# EAGLE design BSB-Board (EAGLE 7.6.0)
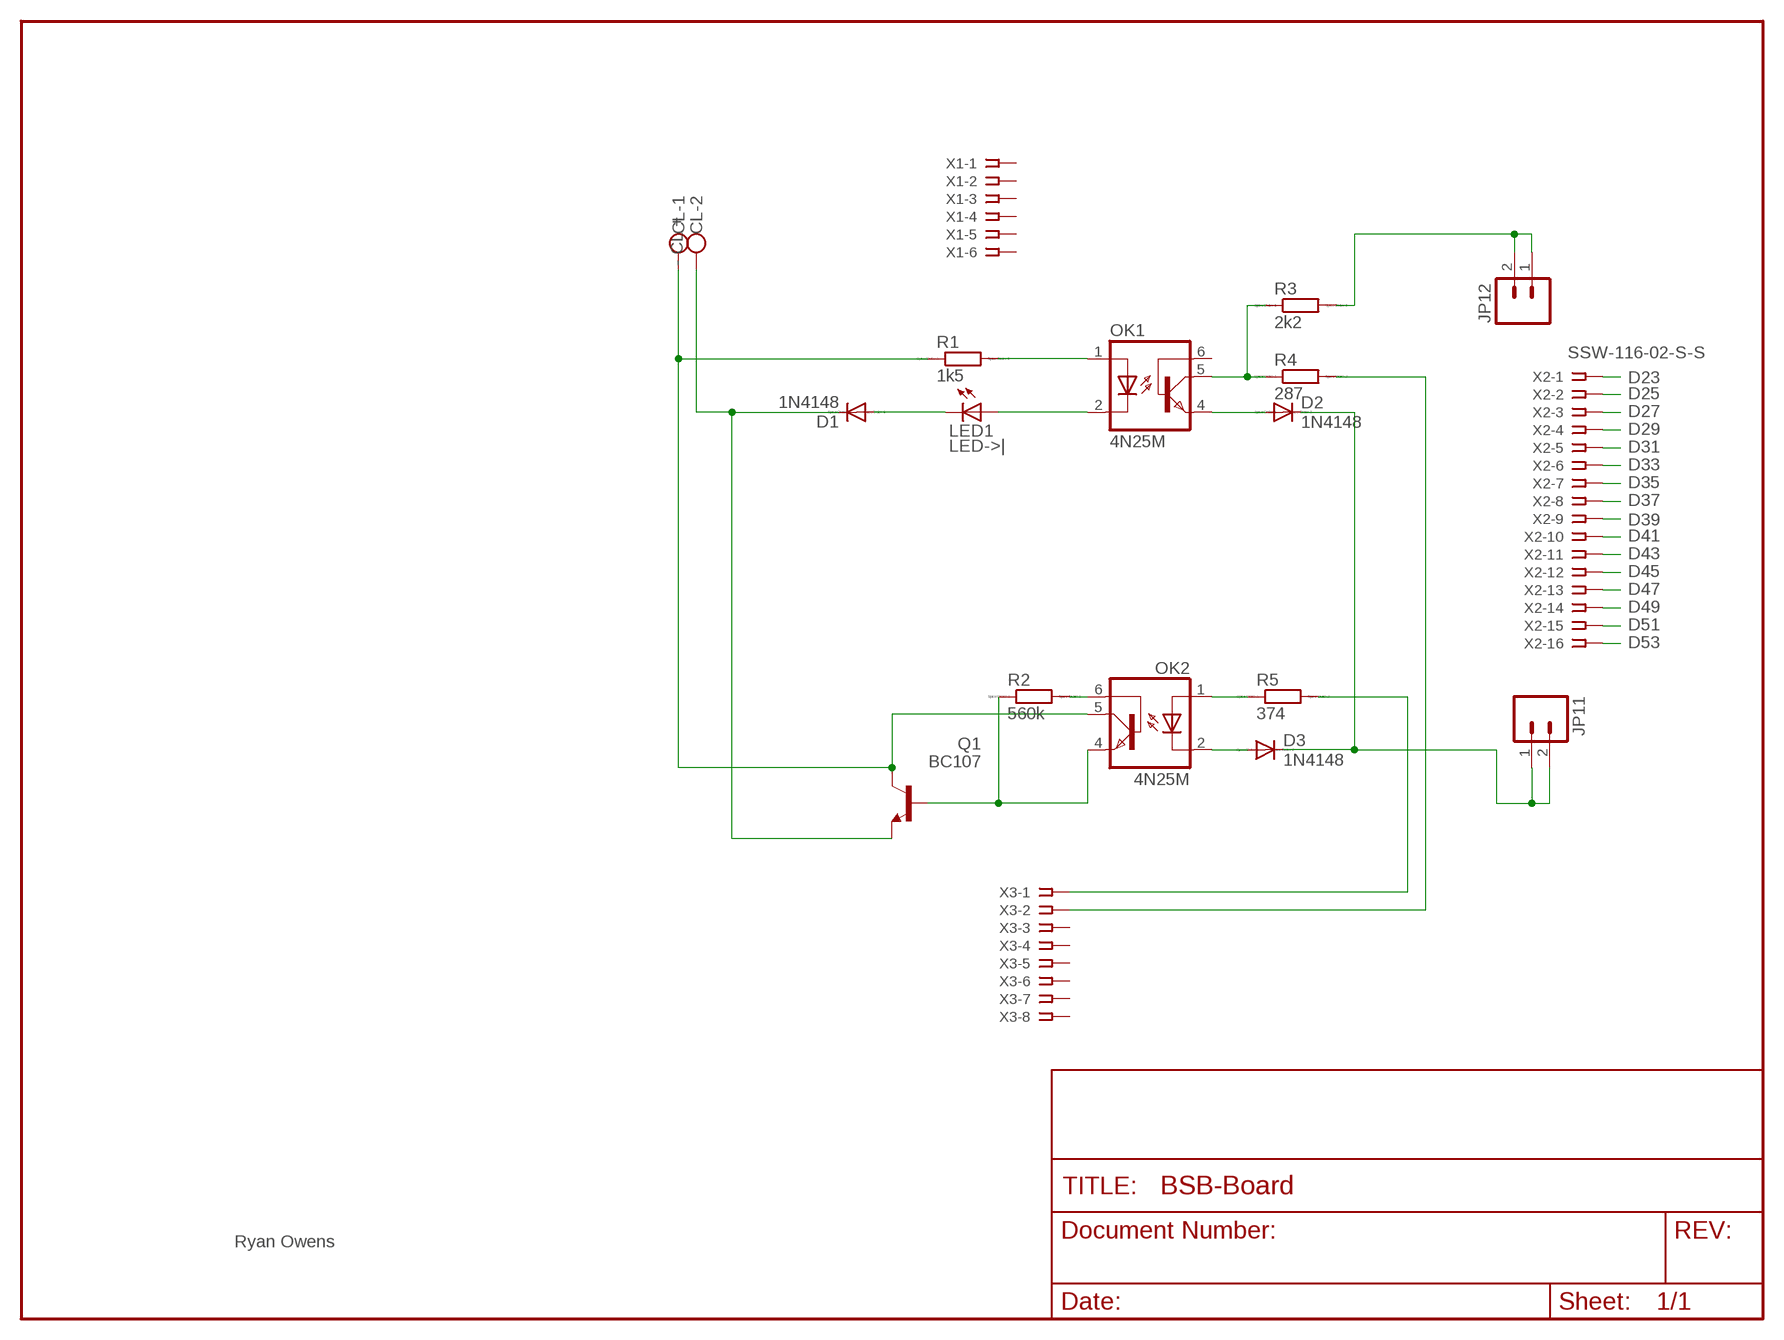
[diagram p0: schematic, sheet 1]

## Parts
CL  - CL +  W237-102  [W237-102]
D1  1N4148  1N4148DO35-7  [DO35-7]
D2  1N4148  1N4148DO35-7  [DO35-7]
D3  1N4148  1N4148DO35-7  [DO35-7]
JP11  M02LOCK  [1X02_LOCK]
JP12  M02LOCK  [1X02_LOCK]
LED1  LED->|  LEDSQR2X5  [LED2X5]
OK1  4N25M  [DIL06]
OK2  4N25M  [DIL06]
Q1  BC107  [TO18]
R1  1k5  R0204/7  [0204/7]
R2  560k  R0207/10  [0207/10]
R3  2k2  R0204/7  [0204/7]
R4  287  R0204/7  [0204/7]
R5  374  R0204/7  [0204/7]
X1  SSW-106-02-S-S  [SSW-106-02-S-S]
X2  SSW-116-02-S-S  [SSW-116-02-S-S]
X3  SSW-108-02-S-S  [SSW-108-02-S-S]

## Nets
A14: R4.2 X3.2
A15: R5.2 X3.1
D23: X2.1
D25: X2.2
D27: X2.3
D29: X2.4
D31: X2.5
D33: X2.6
D35: X2.7
D37: X2.8
D39: X2.9
D41: X2.10
D43: X2.11
D45: X2.12
D47: X2.13
D49: X2.14
D51: X2.15
D53: X2.16
GND: D2.C D3.C JP11.1 JP11.2
N$1: OK1.1(A) R1.2
N$2: LED1.A OK1.2(C)
N$3: OK2.6(BAS) R2.2
N$4: D1.A LED1.K(C)
N$5: OK2.4(EMI) Q1.2(B) R2.1
N$6: CL.1 OK2.5(COL) Q1.3(C) R1.1
N$7: CL.2 D1.C Q1.1(E)
N$8: OK1.5(COL) R3.1 R4.1
N$9: D2.A OK1.4(EMI)
N$11: OK2.1(A) R5.1
N$13: D3.A OK2.2(C)
N$14: JP12.1 JP12.2 R3.2
Unconnected: OK1.6(BAS) X1.1 X1.2 X1.3 X1.4 X1.5 X1.6 X3.3 X3.4 X3.5 X3.6 X3.7 X3.8

## Notes on the sheet
- Ryan Owens

## Library data of the parts
CL = con-wago-500:W237-102: WAGO SCREW CLAMP; MPN: 237-102; OC_FARNELL: unknown; OC_NEWARK: 70K9898
D1-D3 = diode:1N4148: DIODE high speed (Philips)
JP11 JP12 = SparkFun:M02: Header 2 Standard 2-pin 0.1" header. Use with straight break away headers (SKU : PRT-00116), right angle break away headers (PRT-00553), swiss pins (PRT-00743), machine pins (PRT-00117), and female headers (PRT-00115). Molex polarized connector foot print use with SKU : PRT-08233 with associated crimp pins and housings.
LED1 = led:LED: LED OSRAM: - CHIPLED LG R971, LG N971, LY N971, LG Q971, LY Q971, LO R971, LY R971 LH N974, LH R974 LS Q976, LO Q976, LY Q976 LO Q996 - Hyper CHIPLED LW Q18S LB Q993, LB Q99A, LB R99A - SideLED LS A670, LO A670, LY A670, LG A670, LP A670 LB A673, LV A673, LT A673, LW A673 LH A674 LY A675 LS A676, LA A676, LO A676, LY A676, LW A676 LS A679, LY A679, LG A679 - Hyper Micro SIDELED® LS Y876, LA Y876, LO Y876, LY Y876 LT Y87S - SmartLED LW L88C, LW L88S LB L89C, LB L89S, LG L890 LS L89K, LO L89K, LY L89K LS L896, LA L896, LO L896, LY L896 - TOPLED LS T670, LO T670, LY T670, LG T670, LP T670 LSG T670, LSP T670, LSY T670, LOP T670, LYG T670 LG T671, LOG T671, LSG T671 LB T673, LV T673, LT T673, LW T673 LH T674 LS T676, LA T676, LO T676, LY T676, LB T676, LH T676, LSB T676, LW T676 LB T67C, LV T67C, LT T67C, LS T67K, LO T67K, LY T67K, LW E67C LS E67B, LA E67B, LO E67B, LY E67B, LB E67C, LV E67C, LT E67C LW T67C LS T679, LY T679, LG T679 LS T770, LO T770, LY T770, LG T770, LP T770 LB T773, LV T773, LT T773, LW T773 LH T774 LS E675, LA E675, LY E675, LS T675 LS T776, LA T776, LO T776, LY T776, LB T776 LHGB T686 LT T68C, LB T68C - Hyper Mini TOPLED® LB M676 - Mini TOPLED Santana® LG M470 LS M47K, LO M47K, LY M47K Source: http://www.osram.convergy.de LUXEON: - LUMILED® LXK2-PW12-R00, LXK2-PW12-S00, LXK2-PW14-U00, LXK2-PW14-V00 LXK2-PM12-R00, LXK2-PM12-S00, LXK2-PM14-U00 LXK2-PE12-Q00, LXK2-PE12-R00, LXK2-PE12-S00, LXK2-PE14-T00, LXK2-PE14-U00 LXK2-PB12-K00, LXK2-PB12-L00, LXK2-PB12-M00, LXK2-PB14-N00, LXK2-PB14-P00, LXK2-PB14-Q00 LXK2-PR12-L00, LXK2-PR12-M00, LXK2-PR14-Q00, LXK2-PR14-R00 LXK2-PD12-Q00, LXK2-PD12-R00, LXK2-PD12-S00 LXK2-PH12-R00, LXK2-PH12-S00 LXK2-PL12-P00, LXK2-PL12-Q00, LXK2-PL12-R00 Source: www.luxeon.com KINGBRIGHT: KA-3528ASYC Source: www.kingbright.com
OK1 OK2 = optocoupler:4N*?M: General Purpose 6-Pin Phototransistor Optocouplers Source: http://www.fairchildsemi.com/ds/4N/4N35-M.pdf; MPN: 4N25-M; OC_FARNELL: 1021349; OC_NEWARK: 98K9084
Q1 = transistor-npn:BC107: NPN Transistor
R1-R5 = eagle-ltspice:R: RESISTOR, European symbol; SPICEMODEL: NONE; SPICEPREFIX: R
X1 = con-samtec:SSW-106-02-S-S: THROUGH-HOLE .025" SQ POST SOCKET Source: Samtec SSW.pdf; MPN: SSW-106-02-S-S; OC_FARNELL: unknown; OC_NEWARK: 11P9416
X2 = con-samtec:SSW-116-02-S-S: THROUGH-HOLE .025" SQ POST SOCKET Source: Samtec SSW.pdf; MPN: SSW-116-02-S-S; OC_FARNELL: unknown; OC_NEWARK: 29C5896
X3 = con-samtec:SSW-108-02-S-S: THROUGH-HOLE .025" SQ POST SOCKET Source: Samtec SSW.pdf; MPN: SSW-108-02-S-S; OC_FARNELL: unknown; OC_NEWARK: 11P9448

## Board
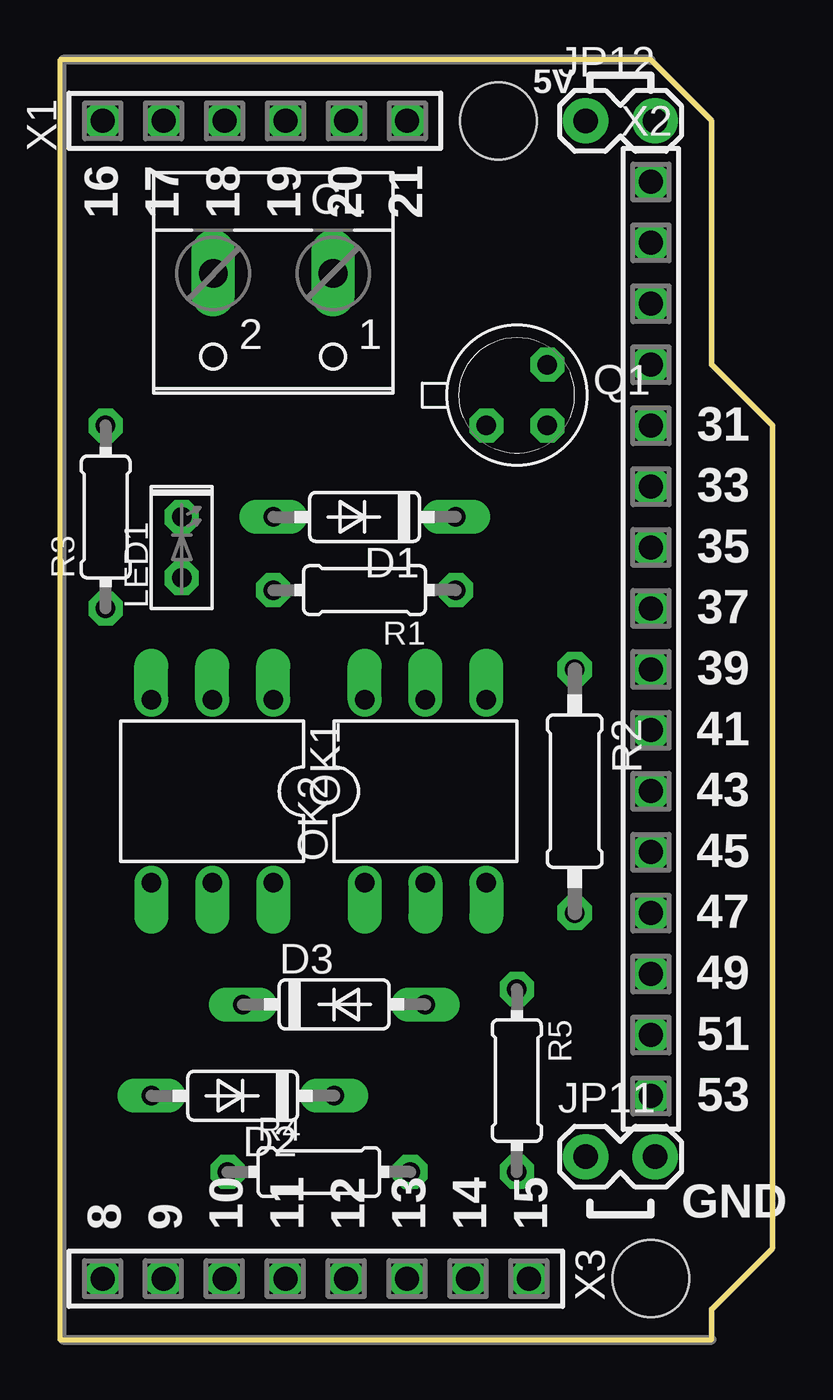
[diagram p1: board, top side]
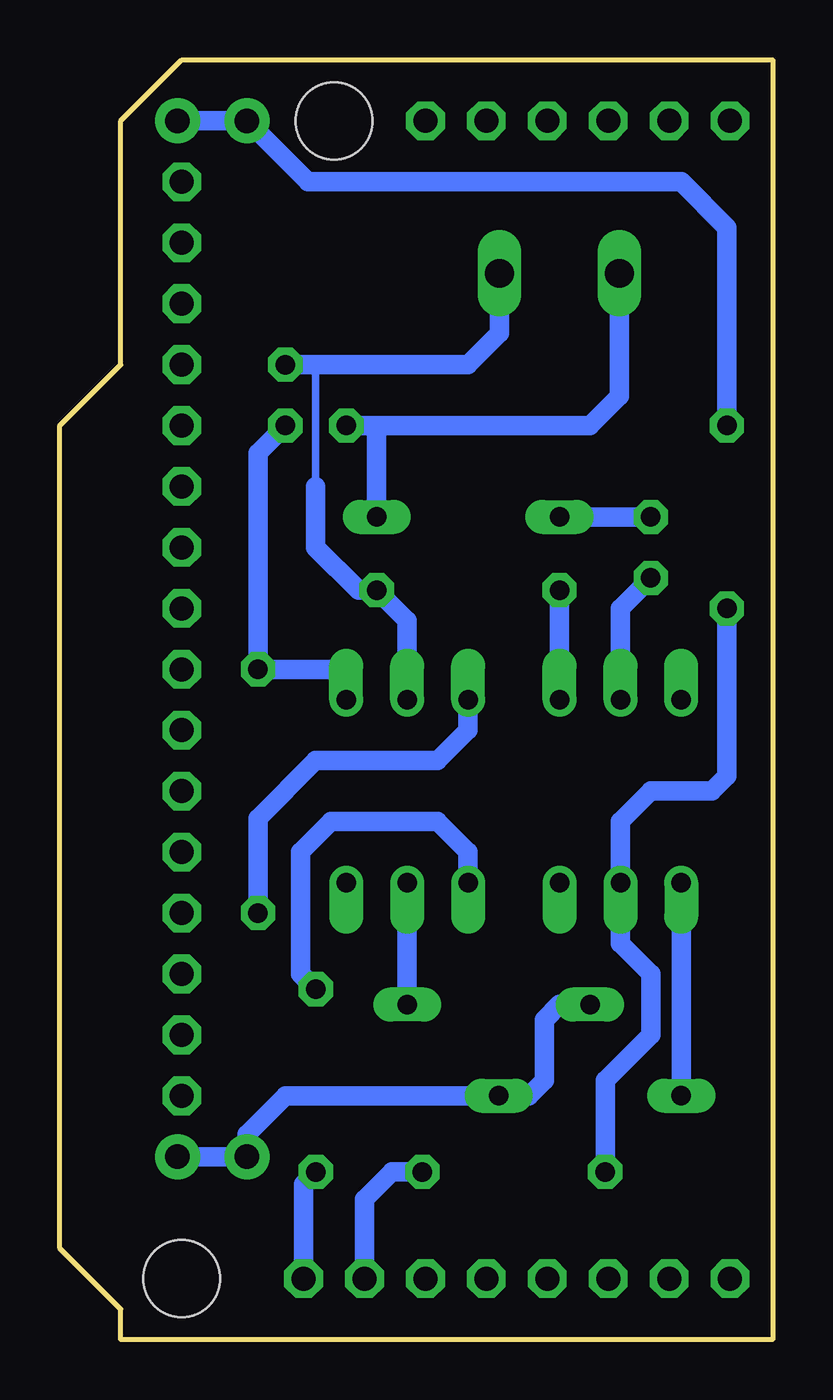
[diagram p2: board, bottom side, seen from below]

Size 29.72 x 53.34 mm. Coordinates in mm from the lower left corner, seen from the top.
Outline: 0,0 27.18,0 27.18,1.27 29.72,3.81 29.72,38.1 27.18,40.64 27.18,50.8 24.64,53.34 0,53.34 0,0
Copper layers (1*16): Top 0.035mm / dielectric 1.5mm / Bottom 0.035mm
Design rules "SparkFun *": minimum track width 8mil, minimum drill 20mil, track to track 12mil, track to pad 12mil, pad to pad 12mil, via to via 8mil, smd to smd 8mil, copper to edge 10mil, drill to drill 8mil, minimum pad ring 12mil, minimum via ring 10mil, stop-mask expansion 4mil, vias tented up to drill 25mil, thermal gap 10mil
Holes 3.2 mm at 18.29,50.8 24.64,2.54

### Footprints (pad centres in the part's own frame; a part is rotated, then mirrored left to right if it is on the bottom)
W237-102 = drill 1.194 long: 1 -2.5,-1.27; 2 2.5,-1.27
DO35-7 = drill 0.813 long: A 3.81,0; C -3.81,0
1X02_LOCK = drill 1.016 pad 1.88: 1 -0.178,0; 2 2.718,0
LED2X5 = drill 0.813 octagon: A -1.27,0; K 1.27,0
DIL06 = drill 0.813 offset: 1 -2.54,-3.81; 2 0,-3.81; 3 2.54,-3.81; 4 2.54,3.81; 5 0,3.81; 6 -2.54,3.81
TO18 = drill 0.813 octagon: 1 -1.27,-1.27; 2 1.27,-1.27; 3 1.27,1.27
0204/7 = drill 0.813 octagon: 1 -3.81,0; 2 3.81,0
0207/10 = drill 0.813 octagon: 1 -5.08,0; 2 5.08,0
SSW-106-02-S-S = drill 1 pad 1.5 octagon: 1 -6.35,0; 2 -3.81,0; 3 -1.27,0; 4 1.27,0; 5 3.81,0; 6 6.35,0
SSW-116-02-S-S = drill 1 pad 1.5 octagon: 1 -19.05,0; 2 -16.51,0; 3 -13.97,0; 4 -11.43,0; 5 -8.89,0; 6 -6.35,0; 7 -3.81,0; 8 -1.27,0; 9 1.27,0; 10 3.81,0; 11 6.35,0; 12 8.89,0; 13 11.43,0; 14 13.97,0; 15 16.51,0; 16 19.05,0
SSW-108-02-S-S = drill 1 pad 1.5 octagon: 1 -8.89,0; 2 -6.35,0; 3 -3.81,0; 4 -1.27,0; 5 1.27,0; 6 3.81,0; 7 6.35,0; 8 8.89,0

### Placement (x,y rotation side)
CL  8.89,43.18 180 top
D1  12.7,34.29 180 top
D2  7.62,10.16 180 top
D3  11.43,13.97 0 top
JP11  22.1,7.62 0 top
JP12  22.1,50.8 0 top
LED1  5.08,33.02 90 top
OK1  6.35,22.86 180 top
OK2  15.24,22.86 0 top
Q1  19.05,39.37 0 top
R1  12.7,31.24 180 top
R2  21.46,22.86 270 top
R3  1.91,34.29 90 top
R4  10.79,6.99 0 top
R5  19.05,10.79 270 top
X1  8.13,50.8 0 top
X2  24.64,29.21 270 top
X3  10.67,2.54 180 top

### Tracks (layer width: path | path; a pad name or v marks a point on that pad's centre or on a via)
A14
  Bottom 0.813: X3.2 17.02,5.84 15.88,6.99 R4.2
A15
  Bottom 0.813: X3.1 19.56,6.48 R5.2
GND
  Bottom 0.813: JP11.2 JP11.1 21.92,8.56 20.32,10.16 D2.C 10.16,10.16 9.53,10.79 9.53,13.34 8.89,13.97 D3.C
N$1
  Bottom 0.813: R1.2 OK1.1
N$2
  Bottom 0.813: OK1.2 6.35,30.48 LED1.A
N$3
  Bottom 0.813: R2.2 21.46,21.72 19.05,24.13 13.97,24.13 12.7,25.4 OK2.6
N$4
  Bottom 0.813: LED1.K D1.A
N$5
  Bottom 0.813: OK2.4 17.78,27.94 R2.1 21.46,36.96 Q1.2
N$6
  Bottom 0.305: 19.05,35.56 19.05,40.64
  Bottom 0.813: OK2.5 15.24,29.97 R1.1 17.27,31.24 19.05,33.02 19.05,35.56 | CL.1 11.39,41.95 12.7,40.64 19.05,40.64 Q1.3
N$7
  Bottom 0.813: CL.2 6.39,39.33 7.62,38.1 16.51,38.1 | 16.51,38.1 Q1.1 | D1.C 16.51,38.1
N$8
  Bottom 0.813: R3.1 1.91,23.5 2.54,22.86 5.08,22.86 6.35,21.59 OK1.5 6.35,16.51 5.08,15.24 5.08,12.7 6.99,10.79 R4.1
N$9
  Bottom 0.813: OK1.4 D2.A
N$11
  Bottom 0.813: OK2.1 12.7,20.32 13.97,21.59 18.41,21.59 19.68,20.32 19.68,15.24 R5.1
N$13
  Bottom 0.813: OK2.2 D3.A
N$14
  Bottom 0.813: R3.2 1.91,46.35 3.81,48.26 19.38,48.26 JP12.1 JP12.2

### Text on the board
tPlace: 5V | 16 | 17 | 18 | 19 | 20 | 21 | 31 | 33 | 35 | 37 | 39 | 41 | 43 | 45 | 47 | 49 | 51 | 53 | 8 | 9 | 10 | 11 | 12 | 13 | 14 | 15 | GND
tValues: Schematics by Gero Schumacher / Board layout by Frederik Holst